# EAGLE schematic CCCCL (EAGLE 6.5.0)
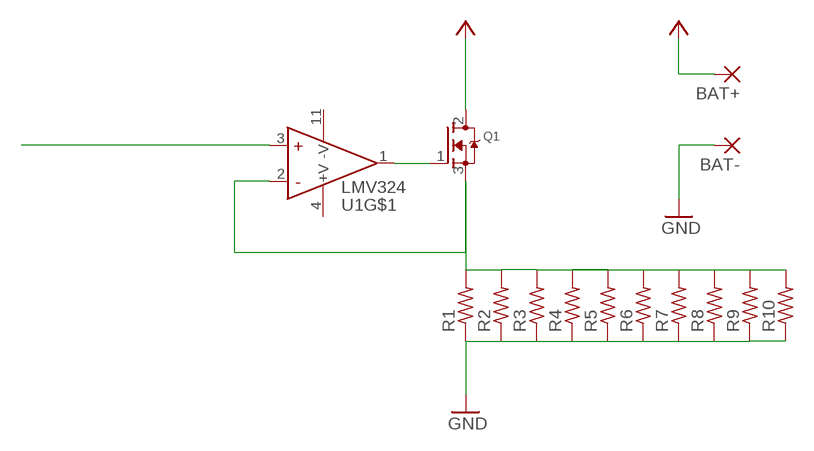
[diagram p0: schematic, sheet 1]

## Parts
BAT+  3,17/1,3  [3,17/1,3]
BAT-  3,17/1,3  [3,17/1,3]
Q1  MOSFET-NGDS_TO220V  [TO220V]
R1  R-US_0309/12  [0309/12]
R2  R-US_0309/12  [0309/12]
R3  R-US_0309/12  [0309/12]
R4  R-US_0309/12  [0309/12]
R5  R-US_0309/12  [0309/12]
R6  R-US_0309/12  [0309/12]
R7  R-US_0309/12  [0309/12]
R8  R-US_0309/12  [0309/12]
R9  R-US_0309/12  [0309/12]
R10  R-US_0309/12  [0309/12]
U1  LMV324  [SO014]

## Nets
+3V3: Q1.2(D)
GND: BAT-.1(P) R1.1 R2.1 R3.1 R4.1 R5.1 R6.1 R7.1 R8.1 R9.1 R10.1
N$1: Q1.1(G) U1.1(OUT)
N$2: Q1.3(S) R1.2 R2.2 R3.2 R4.2 R5.2 R6.2 R7.2 R8.2 R9.2 R10.2 U1.2(-IN)
N$3: U1.3(+IN)
VB: BAT+.1(P) ; supply symbol labelled +3V3

## Power pins joined to a net without a drawn wire
+IN: U1.5(+IN) U1.10(+IN) U1.12(+IN)
+V: U1.4(+V)
-IN: U1.6(-IN) U1.9(-IN) U1.13(-IN)
-V: U1.11(-V)
OUT: U1.7(OUT) U1.8(OUT) U1.14(OUT)

## Library data of the parts
BAT+ BAT- = wirepad:3,17/1,3: THROUGH-HOLE PAD
Q1 = adafruit:MOSFET-N: N-Channel Mosfet 2N7002E - 60V 260mA SOT23 [Digikey: 2N7002ET1GOSTR-ND] - REEL BSH103 - 30V 850mA SOT23 [Digikey: 568-5013-1-ND]
R1-R10 = resistor:R-US_: RESISTOR, American symbol
U1 = SparkFun-AnalogIC:LMV324: Jellybean quad op-amp; PROD_ID: IC-08227